# Altium schematic sheet Power.SchDoc
size A4
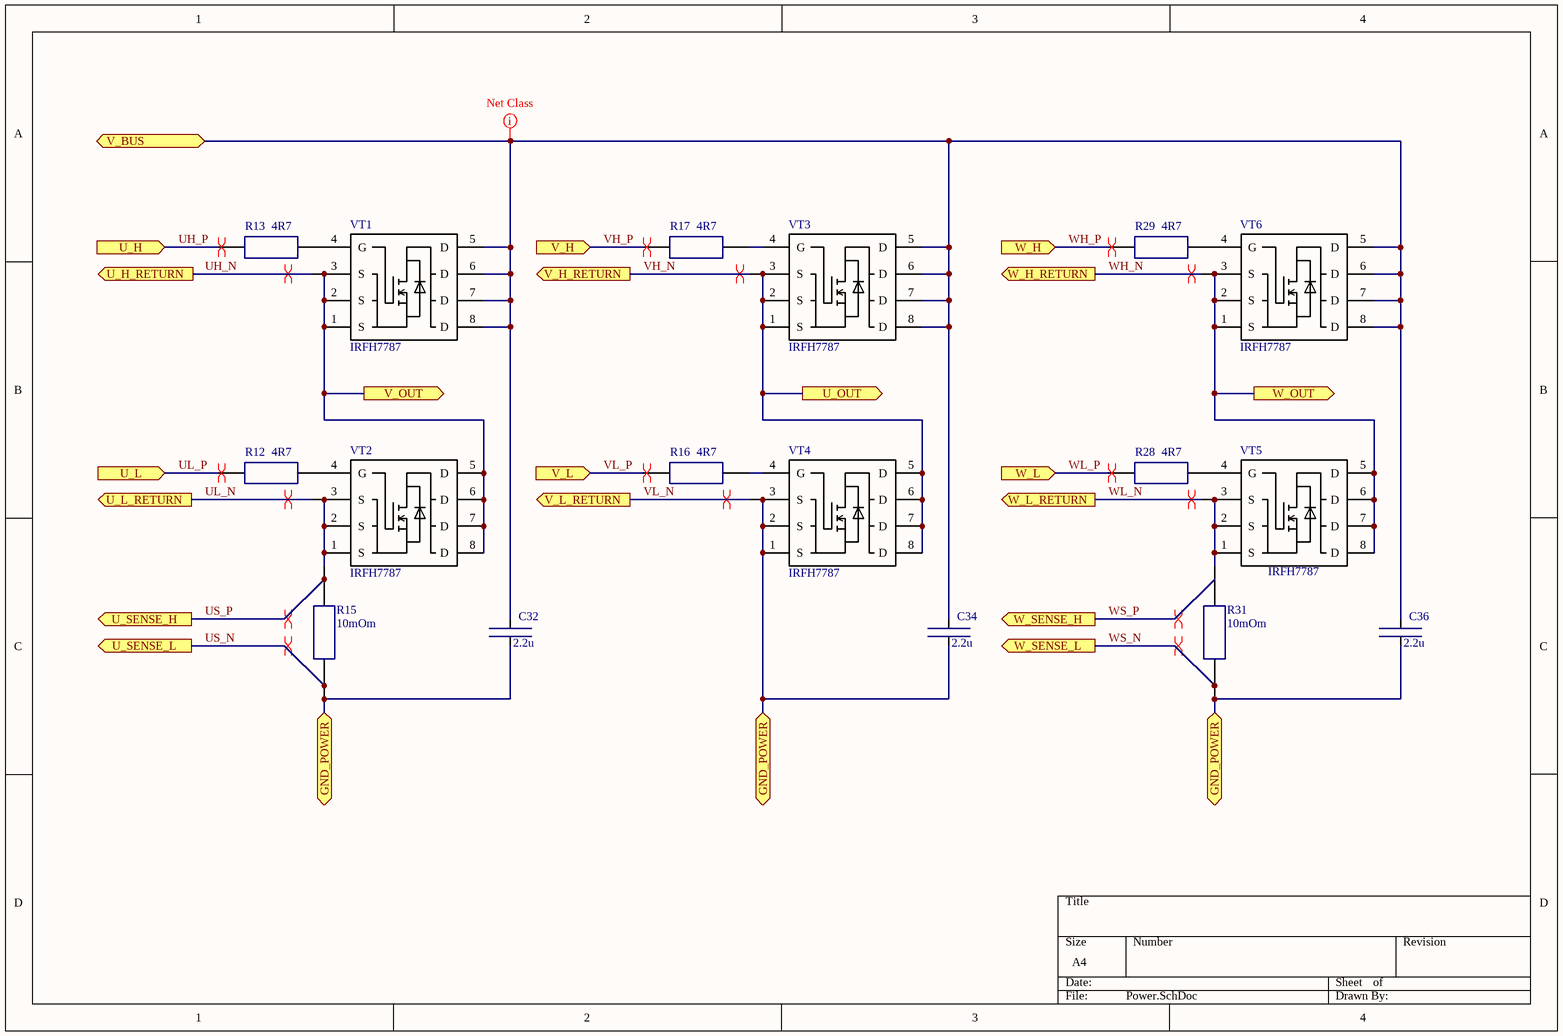
[diagram p0: Power.SchDoc]

## Parts
C32  2.2u  [EIA CC1210]
C34  2.2u  [EIA CC1210]
C36  2.2u  [EIA CC1210]
NT4  NET_TIE  [NET_TIE]  (value not drawn)  (net tie, no BOM)
NT5  NET_TIE  [NET_TIE]  (value not drawn)  (net tie, no BOM)
NT6  NET_TIE  [NET_TIE]  (value not drawn)  (net tie, no BOM)
NT7  NET_TIE  [NET_TIE]  (value not drawn)  (net tie, no BOM)
NT8  NET_TIE  [NET_TIE]  (value not drawn)  (net tie, no BOM)
NT9  NET_TIE  [NET_TIE]  (value not drawn)  (net tie, no BOM)
NT10  NET_TIE  [NET_TIE]  (value not drawn)  (net tie, no BOM)
NT11  NET_TIE  [NET_TIE]  (value not drawn)  (net tie, no BOM)
NT12  NET_TIE  [NET_TIE]  (value not drawn)  (net tie, no BOM)
NT13  NET_TIE  [NET_TIE]  (value not drawn)  (net tie, no BOM)
R12  4R7  [RESC1608X05N(0603)]
R13  4R7  [RESC1608X05N(0603)]
R15  10mOm  [RESC6332X06N(2512)]
R16  4R7  [RESC1608X05N(0603)]
R17  4R7  [RESC1608X05N(0603)]
R28  4R7  [RESC1608X05N(0603)]
R29  4R7  [RESC1608X05N(0603)]
R31  10mOm  [RESC6332X06N(2512)]
VT1  IRFH7787  [PQFN 5x6]
VT2  IRFH7787  [PQFN 5x6]
VT3  IRFH7787  [PQFN 5x6]
VT4  IRFH7787  [PQFN 5x6]
VT5  IRFH7787  [PQFN 5x6]
VT6  IRFH7787  [PQFN 5x6]

## Ports
GND_POWER, U_H (in), U_H_RETURN (out), U_L (in), U_L_RETURN (out), U_OUT (out), U_SENSE_H (out), U_SENSE_L (out), V_BUS, V_H (in), V_H_RETURN (out), V_L (in), V_L_RETURN (out), V_OUT (out), W_H (in), W_H_RETURN (out), W_L (in), W_L_RETURN (out), W_OUT (out), W_SENSE_H (out), W_SENSE_L (out)

## Nets
GND_POWER: C32.2 C34.2 C36.2 NT7.1 NT9.1 NT13.1 VT4.1(S) VT4.2(S) VT4.3(S) ; port GND_POWER
U_OUT: NT8.1 VT3.1(S) VT3.2(S) VT3.3(S) VT4.5(D) VT4.6(D) VT4.7(D) VT4.8(D) ; port U_OUT
UH_N: NT4.2 ; port U_H_RETURN
UH_P: R13.1 ; port U_H
UL_N: NT5.2 ; port U_L_RETURN
UL_P: R12.1 ; port U_L
US_N: NT7.2 R15.2 ; port U_SENSE_L
US_P: NT6.1 R15.1 ; port U_SENSE_H
V_BUS: C32.1 C34.1 C36.1 VT1.5(D) VT1.6(D) VT1.7(D) VT1.8(D) VT3.5(D) VT3.6(D) VT3.7(D) VT3.8(D) VT6.5(D) VT6.6(D) VT6.7(D) VT6.8(D) ; port V_BUS
V_OUT: NT4.1 VT1.1(S) VT1.2(S) VT1.3(S) VT2.5(D) VT2.6(D) VT2.7(D) VT2.8(D) ; port V_OUT
VH_N: NT8.2 ; port V_H_RETURN
VH_P: R17.1 ; port V_H
VL_N: NT9.2 ; port V_L_RETURN
VL_P: R16.1 ; port V_L
W_OUT: NT10.1 VT5.5(D) VT5.6(D) VT5.7(D) VT5.8(D) VT6.1(S) VT6.2(S) VT6.3(S) ; port W_OUT
WH_N: NT10.2 ; port W_H_RETURN
WH_P: R29.1 ; port W_H
WL_N: NT11.2 ; port W_L_RETURN
WL_P: R28.1 ; port W_L
WS_N: NT13.2 R31.2 ; port W_SENSE_L
WS_P: NT12.1 R31.1 ; port W_SENSE_H
NetNT5_1: NT5.1 NT6.2 VT2.1(S) VT2.2(S) VT2.3(S)
NetNT11_1: NT11.1 NT12.2 VT5.1(S) VT5.2(S) VT5.3(S)
NetR12_2: R12.2 VT2.4(G)
NetR13_2: R13.2 VT1.4(G)
NetR16_2: R16.2 VT4.4(G)
NetR17_2: R17.2 VT3.4(G)
NetR28_2: R28.2 VT5.4(G)
NetR29_2: R29.2 VT6.4(G)

## Layout directives
differential pair: UH_N, UH_P, UL_N, UL_P, US_N, US_P, VH_N, VH_P, VL_N, VL_P, WH_N, WH_P, WL_N, WL_P, WS_N, WS_P
net class Undefined: V_BUS

## Library data of the parts
C32 C34 C36 = Ceramic Chip Capacitor: Value: 2.2u, 100V; Order Number: C3225X7R2A225K; Distributor: TDK Corporation; Package: CC1210
NT4-NT13 = Net tie
R12 R13 R16 R17 R28 R29 = SMD: Order Number: ERJ-3GEYJ4R7V; Value: 4R7; Package: RESC1608X05N(0603); Distributor: Panasonic
R15 R31 = SMD: Value: 1mOm; Order Number: WSL25121L000FEA; Package: 2512; Distributor: Vishay / Dale
VT1-VT6 = IRFH7787: Order Number: IRFH7787PbF